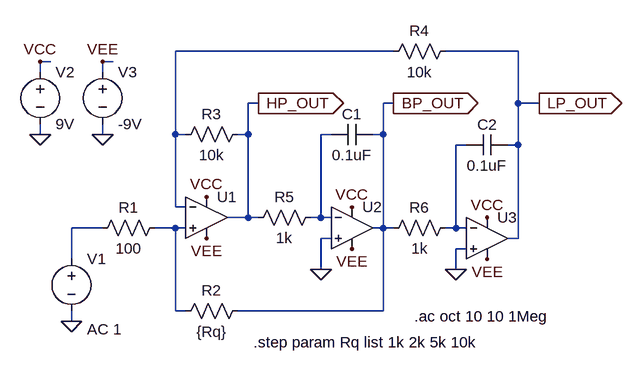
[diagram p0: schematic SVF_sim_Q_10kohm.asc]
SVF_sim_Q_10kohm.asc, the LTspice schematic file:
Version 4
SHEET 1 880 680
WIRE 320 -160 -16 -160
WIRE 512 -160 400 -160
WIRE -208 -144 -224 -144
WIRE -112 -144 -128 -144
WIRE -224 -128 -224 -144
WIRE -128 -128 -128 -144
WIRE 112 -80 96 -80
WIRE 320 -80 304 -80
WIRE 512 -80 512 -160
WIRE 544 -80 512 -80
WIRE -224 -32 -224 -48
WIRE -128 -32 -128 -48
WIRE -16 -32 -16 -160
WIRE 0 -32 -16 -32
WIRE 96 -32 96 -80
WIRE 96 -32 80 -32
WIRE 224 -32 208 -32
WIRE 304 -32 304 -80
WIRE 304 -32 288 -32
WIRE 432 -16 416 -16
WIRE 512 -16 512 -80
WIRE 512 -16 496 -16
WIRE -16 80 -16 -32
WIRE 0 80 -16 80
WIRE 96 96 96 -32
WIRE 96 96 64 96
WIRE 112 96 96 96
WIRE 208 96 208 -32
WIRE 208 96 192 96
WIRE 224 96 208 96
WIRE -128 112 -176 112
WIRE -16 112 -48 112
WIRE 0 112 -16 112
WIRE 304 112 304 -32
WIRE 304 112 288 112
WIRE 320 112 304 112
WIRE 416 112 416 -16
WIRE 416 112 400 112
WIRE 432 112 416 112
WIRE 224 128 208 128
WIRE 512 128 512 -16
WIRE 512 128 496 128
WIRE 432 144 416 144
WIRE -176 160 -176 112
WIRE 208 176 208 128
WIRE 416 176 416 144
WIRE -16 240 -16 112
WIRE 0 240 -16 240
WIRE 304 240 304 112
WIRE 304 240 80 240
WIRE -176 256 -176 240
FLAG -176 256 0
FLAG 208 176 0
FLAG 416 176 0
FLAG 32 64 VCC
FLAG 32 128 VEE
FLAG 256 144 VEE
FLAG 464 160 VEE
FLAG 256 80 VCC
FLAG 464 96 VCC
FLAG 112 -80 HP_OUT
IOPIN 112 -80 Out
FLAG 320 -80 BP_OUT
IOPIN 320 -80 Out
FLAG 544 -80 LP_OUT
IOPIN 544 -80 Out
FLAG -224 -32 0
FLAG -128 -32 0
FLAG -224 -144 VCC
FLAG -128 -144 VEE
SYMBOL Opamps\\UniversalOpamp2 32 96 R0
SYMATTR InstName U1
SYMBOL Opamps\\UniversalOpamp2 256 112 R0
SYMATTR InstName U2
SYMBOL Opamps\\UniversalOpamp2 464 128 R0
SYMATTR InstName U3
SYMBOL res -32 96 R90
WINDOW 0 0 56 VBottom 2
WINDOW 3 32 56 VTop 2
SYMATTR InstName R1
SYMATTR Value 100
SYMBOL res 96 224 R90
WINDOW 0 0 56 VBottom 2
WINDOW 3 32 56 VTop 2
SYMATTR InstName R2
SYMATTR Value {Rq}
SYMBOL res 96 -48 R90
WINDOW 0 0 56 VBottom 2
WINDOW 3 32 56 VTop 2
SYMATTR InstName R3
SYMATTR Value 10k
SYMBOL res 208 80 R90
WINDOW 0 0 56 VBottom 2
WINDOW 3 32 56 VTop 2
SYMATTR InstName R5
SYMATTR Value 1k
SYMBOL voltage -176 144 R0
WINDOW 123 24 124 Left 2
WINDOW 39 0 0 Left 2
SYMATTR Value2 AC 1
SYMATTR InstName V1
SYMATTR Value ""
SYMBOL cap 288 -48 R90
WINDOW 0 0 32 VBottom 2
WINDOW 3 32 32 VTop 2
SYMATTR InstName C1
SYMATTR Value 0.1uF
SYMBOL res 416 96 R90
WINDOW 0 0 56 VBottom 2
WINDOW 3 32 56 VTop 2
SYMATTR InstName R6
SYMATTR Value 1k
SYMBOL cap 496 -32 R90
WINDOW 0 0 32 VBottom 2
WINDOW 3 32 32 VTop 2
SYMATTR InstName C2
SYMATTR Value 0.1uF
SYMBOL res 416 -176 R90
WINDOW 0 0 56 VBottom 2
WINDOW 3 32 56 VTop 2
SYMATTR InstName R4
SYMATTR Value 10k
SYMBOL voltage -224 -144 R0
WINDOW 123 0 0 Left 2
WINDOW 39 0 0 Left 2
SYMATTR InstName V2
SYMATTR Value 9V
SYMBOL voltage -128 -144 R0
WINDOW 123 0 0 Left 2
WINDOW 39 0 0 Left 2
SYMATTR InstName V3
SYMATTR Value -9V
TEXT 352 248 Left 2 !.ac oct 10 10 1Meg
TEXT 104 288 Left 2 !.step param Rq list 1k 2k 5k 10k

The netlist it stands for:
* SVF_sim_Q_10kohm.asc
XU1 N005 N001 VCC VEE HP_OUT level.2 Avol=1Meg GBW=10Meg Slew=10Meg ilimit=25m rail=0 Vos=0 phimargin=45 en=0 enk=0 in=0 ink=0 Rin=500Meg  ; pins IN+ IN- V+ V- OUT
XU2 0 N002 VCC VEE BP_OUT level.2 Avol=1Meg GBW=10Meg Slew=10Meg ilimit=25m rail=0 Vos=0 phimargin=45 en=0 enk=0 in=0 ink=0 Rin=500Meg  ; pins IN+ IN- V+ V- OUT
XU3 0 N003 VCC VEE LP_OUT level.2 Avol=1Meg GBW=10Meg Slew=10Meg ilimit=25m rail=0 Vos=0 phimargin=45 en=0 enk=0 in=0 ink=0 Rin=500Meg  ; pins IN+ IN- V+ V- OUT
R1 N005 N004 100
R2 BP_OUT N005 {Rq}
R3 HP_OUT N001 10k
R5 N002 HP_OUT 1k
V1 N004 0 AC 1
C1 BP_OUT N002 0.1uF
R6 N003 BP_OUT 1k
C2 LP_OUT N003 0.1uF
R4 LP_OUT N001 10k
V2 VCC 0 9V
V3 VEE 0 -9V
.ac oct 10 10 1Meg
.step param Rq list 1k 2k 5k 10k
.lib UniversalOpamps2.sub
.backanno
.end